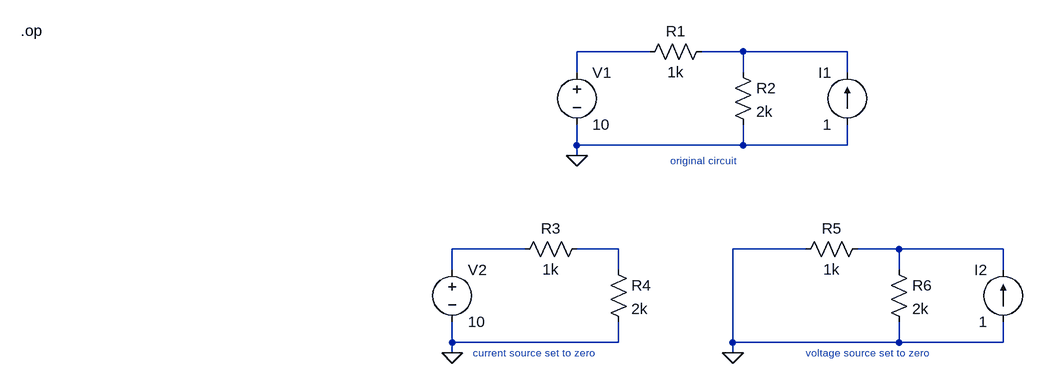
[diagram p0: schematic circuit.asc]
circuit.asc, the LTspice schematic file:
Version 4.1
SHEET 1 900 680
WIRE 320 16 208 16
WIRE 464 16 400 16
WIRE 624 16 464 16
WIRE 208 48 208 16
WIRE 464 48 464 16
WIRE 624 48 624 16
WIRE 208 160 208 128
WIRE 464 160 464 128
WIRE 464 160 208 160
WIRE 624 160 624 128
WIRE 624 160 464 160
WIRE 208 176 208 160
WIRE 128 320 16 320
WIRE 272 320 208 320
WIRE 560 320 448 320
WIRE 704 320 640 320
WIRE 864 320 704 320
WIRE 16 352 16 320
WIRE 272 352 272 320
WIRE 704 352 704 320
WIRE 864 352 864 320
WIRE 16 464 16 432
WIRE 272 464 272 432
WIRE 272 464 16 464
WIRE 448 464 448 320
WIRE 704 464 704 432
WIRE 704 464 448 464
WIRE 864 464 864 432
WIRE 864 464 704 464
WIRE 16 480 16 464
WIRE 448 480 448 464
FLAG 208 176 0
FLAG 16 480 0
FLAG 448 480 0
DATAFLAG 448 144 "I(R2)"
DATAFLAG 256 448 "I(R4)"
DATAFLAG 688 448 "I(R6)"
SYMBOL voltage 208 32 R0
WINDOW 123 0 0 Left 0
WINDOW 39 0 0 Left 0
SYMATTR InstName V1
SYMATTR Value 10
SYMBOL res 416 0 R90
WINDOW 0 0 56 VBottom 2
WINDOW 3 32 56 VTop 2
SYMATTR InstName R1
SYMATTR Value 1k
SYMBOL res 448 32 R0
SYMATTR InstName R2
SYMATTR Value 2k
SYMBOL current 624 128 R180
WINDOW 0 24 80 Left 2
WINDOW 3 24 0 Left 2
WINDOW 123 0 0 Left 0
WINDOW 39 0 0 Left 0
SYMATTR InstName I1
SYMATTR Value 1
SYMBOL voltage 16 336 R0
WINDOW 123 0 0 Left 0
WINDOW 39 0 0 Left 0
SYMATTR InstName V2
SYMATTR Value 10
SYMBOL res 224 304 R90
WINDOW 0 0 56 VBottom 2
WINDOW 3 32 56 VTop 2
SYMATTR InstName R3
SYMATTR Value 1k
SYMBOL res 256 336 R0
SYMATTR InstName R4
SYMATTR Value 2k
SYMBOL res 656 304 R90
WINDOW 0 0 56 VBottom 2
WINDOW 3 32 56 VTop 2
SYMATTR InstName R5
SYMATTR Value 1k
SYMBOL res 688 336 R0
SYMATTR InstName R6
SYMATTR Value 2k
SYMBOL current 864 432 R180
WINDOW 0 24 80 Left 2
WINDOW 3 24 0 Left 2
WINDOW 123 0 0 Left 0
WINDOW 39 0 0 Left 0
SYMATTR InstName I2
SYMATTR Value 1
TEXT -648 -16 Left 2 !.op
TEXT 352 184 Left 1 ;original circuit
TEXT 48 480 Left 1 ;current source set to zero
TEXT 560 480 Left 1 ;voltage source set to zero

The netlist it stands for:
* circuit.asc
V1 N001 0 10
R1 N002 N001 1k
R2 N002 0 2k
I1 0 N002 1
V2 N003 0 10
R3 N004 N003 1k
R4 N004 0 2k
R5 N005 0 1k
R6 N005 0 2k
I2 0 N005 1
.op
* original circuit
* current source set to zero
* voltage source set to zero
.backanno
.end